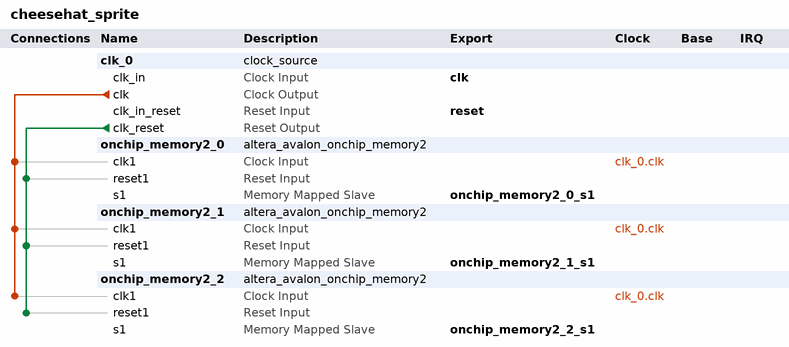
[diagram p0: system contents]
# Platform Designer (Qsys) system cheesehat_sprite, Cyclone V 5CSEMA5F31C6
# Parameters at their usual value, and those the tool derives, are not listed.
package require -exact qsys 24.1
create_system cheesehat_sprite
set_project_property DEVICE_FAMILY {Cyclone V}
set_project_property DEVICE 5CSEMA5F31C6

add_instance clk_0 clock_source 24.1
set_instance_parameter_value clk_0 clockFrequency 50000000

add_instance onchip_memory2_0 altera_avalon_onchip_memory2 24.1
set_instance_parameter_value onchip_memory2_0 dataWidth 8
set_instance_parameter_value onchip_memory2_0 dualPort false
set_instance_parameter_value onchip_memory2_0 initMemContent true
set_instance_parameter_value onchip_memory2_0 initializationFileName C:/Users/rohan/development/capstone/ECE554CPU_WORKING/python_scripts/cheesehat_data.mif
set_instance_parameter_value onchip_memory2_0 memorySize 1024
set_instance_parameter_value onchip_memory2_0 useNonDefaultInitFile true
set_instance_parameter_value onchip_memory2_0 writable false

add_instance onchip_memory2_1 altera_avalon_onchip_memory2 24.1
set_instance_parameter_value onchip_memory2_1 dataWidth 32
set_instance_parameter_value onchip_memory2_1 dualPort false
set_instance_parameter_value onchip_memory2_1 initMemContent true
set_instance_parameter_value onchip_memory2_1 initializationFileName C:/Users/rohan/development/capstone/ECE554CPU_WORKING/python_scripts/cheesehat_pal.mif
set_instance_parameter_value onchip_memory2_1 memorySize 256
set_instance_parameter_value onchip_memory2_1 useNonDefaultInitFile true
set_instance_parameter_value onchip_memory2_1 writable false

add_instance onchip_memory2_2 altera_avalon_onchip_memory2 24.1
set_instance_parameter_value onchip_memory2_2 dataWidth 8
set_instance_parameter_value onchip_memory2_2 dualPort false
set_instance_parameter_value onchip_memory2_2 initMemContent true
set_instance_parameter_value onchip_memory2_2 initializationFileName C:/Users/rohan/development/capstone/ECE554CPU_WORKING/python_scripts/cheesehat_mask.mif
set_instance_parameter_value onchip_memory2_2 memorySize 1024
set_instance_parameter_value onchip_memory2_2 useNonDefaultInitFile true
set_instance_parameter_value onchip_memory2_2 writable false

# connections
add_connection clk_0.clk onchip_memory2_0.clk1 clock
add_connection clk_0.clk onchip_memory2_1.clk1 clock
add_connection clk_0.clk onchip_memory2_2.clk1 clock
add_connection clk_0.clk_reset onchip_memory2_0.reset1 reset
add_connection clk_0.clk_reset onchip_memory2_1.reset1 reset
add_connection clk_0.clk_reset onchip_memory2_2.reset1 reset

# exported interfaces
add_interface clk clock sink
set_interface_property clk EXPORT_OF clk_0.clk_in
add_interface onchip_memory2_0_s1 avalon slave
set_interface_property onchip_memory2_0_s1 EXPORT_OF onchip_memory2_0.s1
add_interface onchip_memory2_1_s1 avalon slave
set_interface_property onchip_memory2_1_s1 EXPORT_OF onchip_memory2_1.s1
add_interface onchip_memory2_2_s1 avalon slave
set_interface_property onchip_memory2_2_s1 EXPORT_OF onchip_memory2_2.s1
add_interface reset reset sink
set_interface_property reset EXPORT_OF clk_0.clk_in_reset

set_interconnect_requirement {$system} qsys_mm.clockCrossingAdapter HANDSHAKE
set_interconnect_requirement {$system} qsys_mm.enableEccProtection FALSE
set_interconnect_requirement {$system} qsys_mm.insertDefaultSlave FALSE
set_interconnect_requirement {$system} qsys_mm.maxAdditionalLatency 1

save_system cheesehat_sprite.qsys
